# Altium schematic sheet Sheet2.SchDoc
size A4
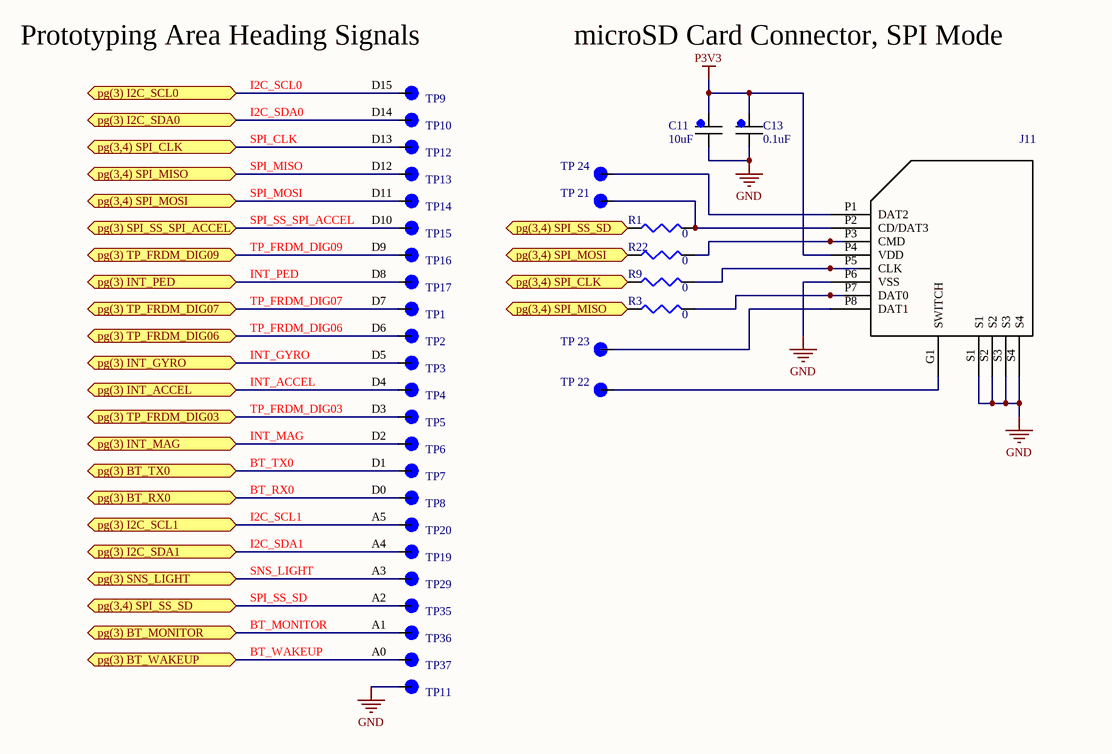
[diagram p0: Sheet2.SchDoc]

## Parts
C11  value 10uF  (hidden comment: E_Cap)
C13  value 0.1uF  (hidden comment: E_Cap)
J11  J11  [105162-0001]  (value not drawn)
R1  value 0  [J1-0603]  (hidden comment: Res3)
R3  value 0  [J1-0603]  (hidden comment: Res3)
R9  value 0  [J1-0603]  (hidden comment: Res3)
R22  value 0  [J1-0603]  (hidden comment: Res3)
TP1  TP  (value not drawn)
TP2  TP  (value not drawn)
TP3  TP  (value not drawn)
TP4  TP  (value not drawn)
TP5  TP  (value not drawn)
TP6  TP  (value not drawn)
TP7  TP  (value not drawn)
TP8  TP  (value not drawn)
TP9  TP  (value not drawn)
TP10  TP  (value not drawn)
TP11  TP  (value not drawn)
TP12  TP  (value not drawn)
TP13  TP  (value not drawn)
TP14  TP  (value not drawn)
TP15  TP  (value not drawn)
TP16  TP  (value not drawn)
TP17  TP  (value not drawn)
TP19  TP  (value not drawn)
TP20  TP  (value not drawn)
TP29  TP  (value not drawn)
TP35  TP  (value not drawn)
TP36  TP  (value not drawn)
TP37  TP  (value not drawn)
TP_21  TP  (value not drawn)
TP_22  TP  (value not drawn)
TP_23  TP  (value not drawn)
TP_24  TP  (value not drawn)

## Ports
pg(3) BT_MONITOR (bidir), pg(3) BT_RX0 (bidir), pg(3) BT_TX0 (bidir), pg(3) BT_WAKEUP (bidir), pg(3) I2C_SCL0 (bidir), pg(3) I2C_SCL1 (bidir), pg(3) I2C_SDA0 (bidir), pg(3) I2C_SDA1 (bidir), pg(3) INT_ACCEL (bidir), pg(3) INT_GYRO (bidir), pg(3) INT_MAG (bidir), pg(3) INT_PED (bidir), pg(3) SNS_LIGHT (bidir), pg(3) SPI_SS_SPI_ACCEL (bidir), pg(3) TP_FRDM_DIG03 (bidir), pg(3) TP_FRDM_DIG06 (bidir), pg(3) TP_FRDM_DIG07 (bidir), pg(3) TP_FRDM_DIG09 (bidir), pg(3,4) SPI_CLK (bidir), pg(3,4) SPI_CLK (in), pg(3,4) SPI_MISO (bidir), pg(3,4) SPI_MOSI (bidir), pg(3,4) SPI_MOSI (in), pg(3,4) SPI_SS_SD (bidir), pg(3,4) SPI_SS_SD (out)

## Nets
GND: C11.7 C13.7 J11.P6(VSS) J11.S1 J11.S2 J11.S3 J11.S4 TP11.1
P3V3: C11.8 C13.8 J11.P4(VDD)
pg(3) BT_MONITOR: TP36.1 ; port pg(3) BT_MONITOR
pg(3) BT_RX0: TP8.1 ; port pg(3) BT_RX0
pg(3) BT_TX0: TP7.1 ; port pg(3) BT_TX0
pg(3) BT_WAKEUP: TP37.1 ; port pg(3) BT_WAKEUP
pg(3) I2C_SCL0: TP9.1 ; port pg(3) I2C_SCL0
pg(3) I2C_SCL1: TP20.1 ; port pg(3) I2C_SCL1
pg(3) I2C_SDA0: TP10.1 ; port pg(3) I2C_SDA0
pg(3) I2C_SDA1: TP19.1 ; port pg(3) I2C_SDA1
pg(3) INT_ACCEL: TP4.1 ; port pg(3) INT_ACCEL
pg(3) INT_GYRO: TP3.1 ; port pg(3) INT_GYRO
pg(3) INT_MAG: TP6.1 ; port pg(3) INT_MAG
pg(3) INT_PED: TP17.1 ; port pg(3) INT_PED
pg(3) SNS_LIGHT: TP29.1 ; port pg(3) SNS_LIGHT
pg(3) SPI_SS_SPI_ACCEL: TP15.1 ; port pg(3) SPI_SS_SPI_ACCEL
pg(3) TP_FRDM_DIG03: TP5.1 ; port pg(3) TP_FRDM_DIG03
pg(3) TP_FRDM_DIG06: TP2.1 ; port pg(3) TP_FRDM_DIG06
pg(3) TP_FRDM_DIG07: TP1.1 ; port pg(3) TP_FRDM_DIG07
pg(3) TP_FRDM_DIG09: TP16.1 ; port pg(3) TP_FRDM_DIG09
pg(3,4) SPI_CLK: R9.1 TP12.1 ; port pg(3,4) SPI_CLK
pg(3,4) SPI_MISO: R3.1 TP13.1 ; port pg(3,4) SPI_MISO
pg(3,4) SPI_MOSI: R22.1 TP14.1 ; port pg(3,4) SPI_MOSI
pg(3,4) SPI_SS_SD: R1.1 TP35.1 ; port pg(3,4) SPI_SS_SD
NetJ11_G1: J11.G1(SWITCH) TP_22.1
NetJ11_P1: J11.P1(DAT2) TP_24.1
NetJ11_P2: J11.P2(CD/DAT3) R1.2 TP_21.1
NetJ11_P3: J11.P3(CMD) R22.2
NetJ11_P5: J11.P5(CLK) R9.2
NetJ11_P7: J11.P7(DAT0) R3.2
NetJ11_P8: J11.P8(DAT1) TP_23.1

## Notes on the sheet
- (near TP9) Prototyping Area Heading Signals
- I2C_SCL0
- D15
- microSD Card Connector, SPI Mode
- I2C_SDA0
- SPI_CLK
- D14
- D13
- SPI_MISO
- SPI_MOSI
- SPI_SS_SPI_ACCEL
- D12
- D11
- D10
- TP_FRDM_DIG09
- INT_PED
- D9
- D8
- TP_FRDM_DIG07
- TP_FRDM_DIG06
- INT_GYRO
- D7
- D6
- D5
- INT_ACCEL
- TP_FRDM_DIG03
- D4
- D3
- INT_MAG
- BT_TX0
- BT_RX0
- D2
- D1
- D0
- I2C_SCL1
- I2C_SDA1
- A5
- A4
- SNS_LIGHT
- SPI_SS_SD
- BT_MONITOR
- A3
- A2
- A1
- BT_WAKEUP
- A0

## Library data of the parts
C11 C13 = E_Cap: Electrolytic capacitor
J11 = J11: CON microSD
R1 R3 R9 R22 = Res3: Resistor; Published: 8-Jun-2000; LatestRevisionDate: 29-May-2009; LatestRevisionNote: IPC-7351 Footprint Added.; PackageReference: J1-0603; Publisher: Altium Limited; PackageDescription: Chip Resistor